# EAGLE design FuncGen_icl8038 (EAGLE 7.6.0)
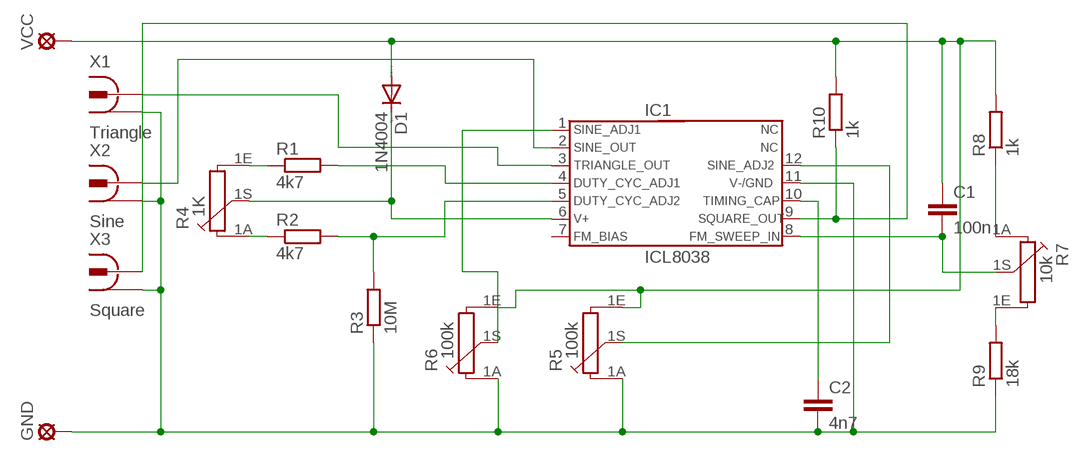
[diagram p0: schematic, sheet 1]

## Parts
C1  100n  C-EU025-025X050  [C025-025X050]
C2  4n7  C-EU025-025X050  [C025-025X050]
D1  1N4004  [DO41-10]
GND  LSP10  [LSP10]
IC1  ICL8038  [ICL8038]
R1  4k7  R-EU_0207/10  [0207/10]
R2  4k7  R-EU_0207/10  [0207/10]
R3  10M  R-EU_0207/10  [0207/10]
R4  1K  PC16S  [PC16S]
R5  100k  PC16S  [PC16S]
R6  100k  PC16S  [PC16S]
R7  10k  PC16S  [PC16S]
R8  1k  R-EU_0207/10  [0207/10]
R9  18k  R-EU_0207/10  [0207/10]
R10  1k  R-EU_0207/10  [0207/10]
VCC  LSP10  [LSP10]
X1  Triangle  736880-49  [736880-49]
X2  Sine  736880-49  [736880-49]
X3  Square  736880-49  [736880-49]

## Nets
N$2: C2.2 GND.MP IC1.11 R3.1 R5.1A R6.1A R9.1 X1.1 X1.1@1 X1.1@2 X2.1 X2.1@1 X2.1@2 X3.1 X3.1@1 X3.1@2
N$3: R1.1 R4.1E
N$4: R2.1 R4.1A
N$5: D1.C IC1.6 R4.1S
N$6: IC1.4 R1.2
N$7: IC1.5 R2.2 R3.2
N$8: IC1.9 R10.1 X3.2
N$9: C1.1 D1.A R5.1E R6.1E R8.2 R10.2 VCC.MP
N$10: IC1.1 R6.1S
N$11: IC1.12 R5.1S
N$12: C2.1 IC1.10
N$13: R7.1E R9.2
N$14: R7.1A R8.1
N$16: C1.2 IC1.8 R7.1S
N$18: IC1.3 X1.2
N$19: IC1.2 X2.2
Unconnected: IC1.7

## Library data of the parts
C1 C2 = rcl:C-EU: CAPACITOR, European symbol
D1 = diode:1N4004: DIODE general purpose rectifier, 1 A
GND VCC = solpad:LSP10: SOLDER PAD drill 1.0 mm, distributor Buerklin, 12H555
IC1 = ICL8038:ICL8038: ICL8038 Intersil ICL8038 Precision Waveform Generator/ Voltage Controlled Oscillator; AVAILABILITY: Unavailable; MF: Harris; MP: ICL8038; PACKAGE: None; PRICE: None
R1-R3 R8-R10 = resistor:R-EU_: RESISTOR, European symbol
R4-R7 = piher:PC16S: POTENTIOMETER single carbon potentiometer, 16 mm, S3ROH; OC_FARNELL: 4452940; OC_NEWARK: unknown
X1-X3 = con-conrad:736880-49: Cinch Connector ( RCA Jack ) Cinch-Einbaukupplung 90º 72345 Vernickelt BKL Electronic Source: Conrad <http://www.conrad.de/ce/de/product/736880>

## Board
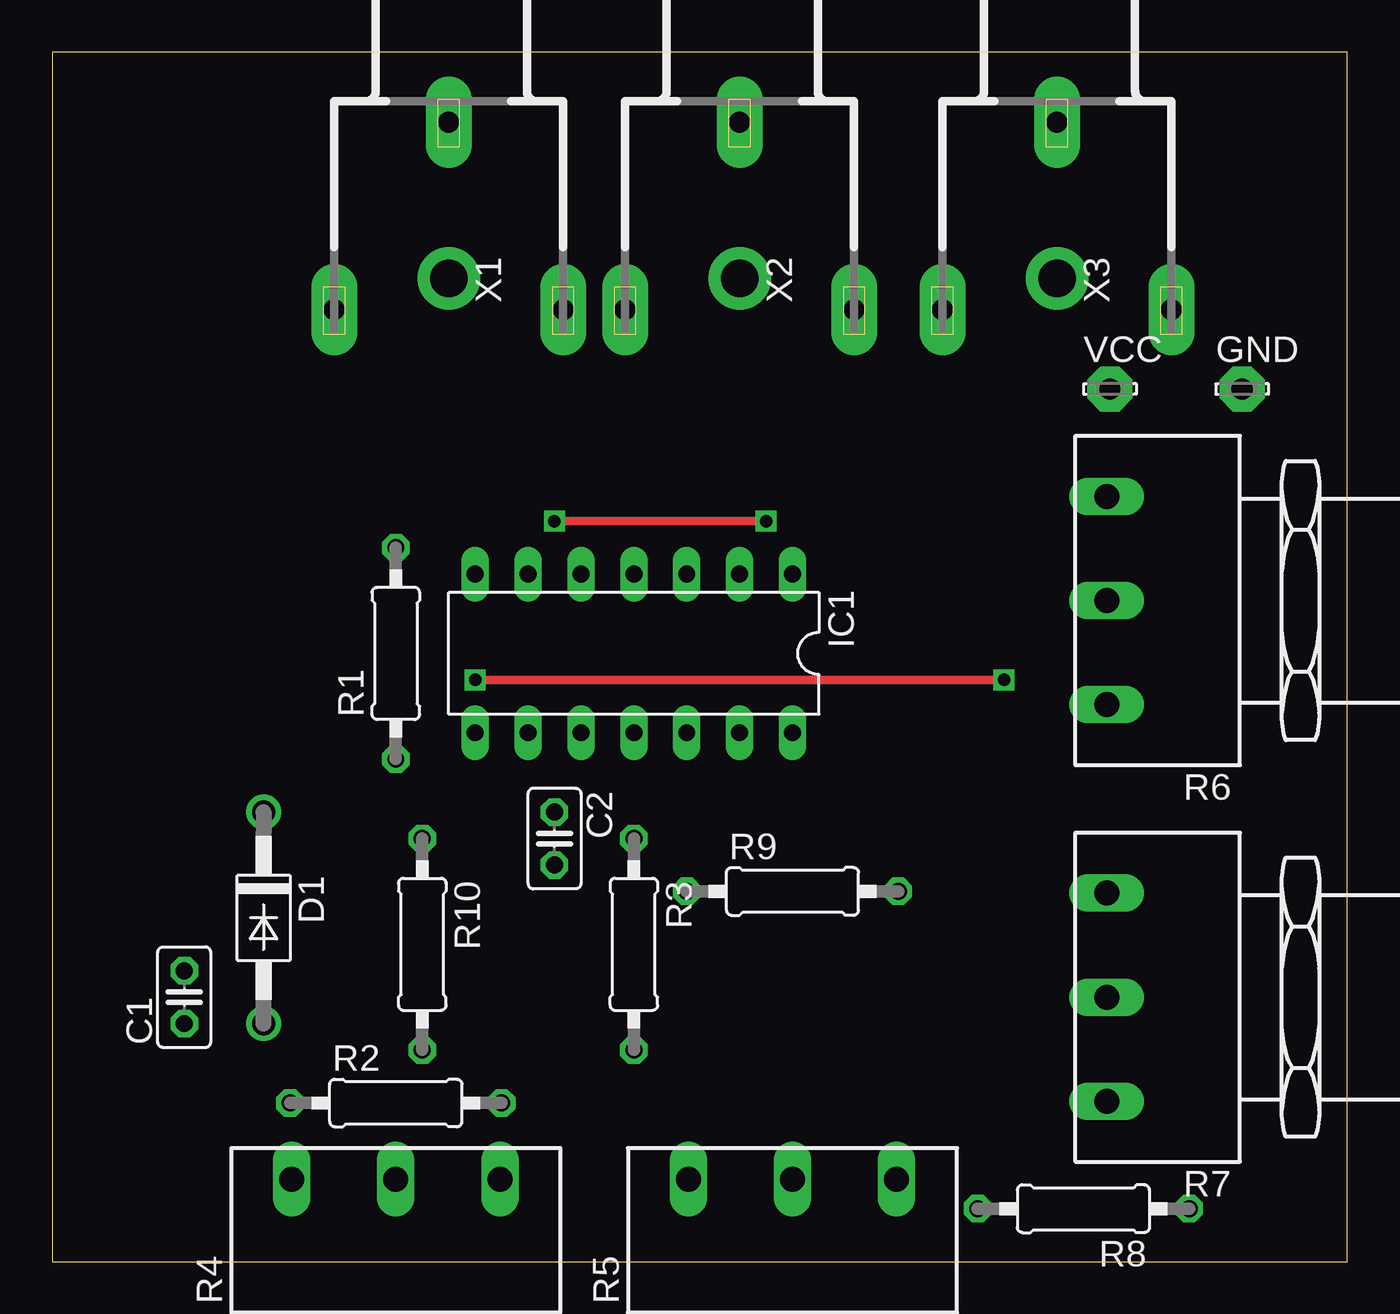
[diagram p1: board, top side]
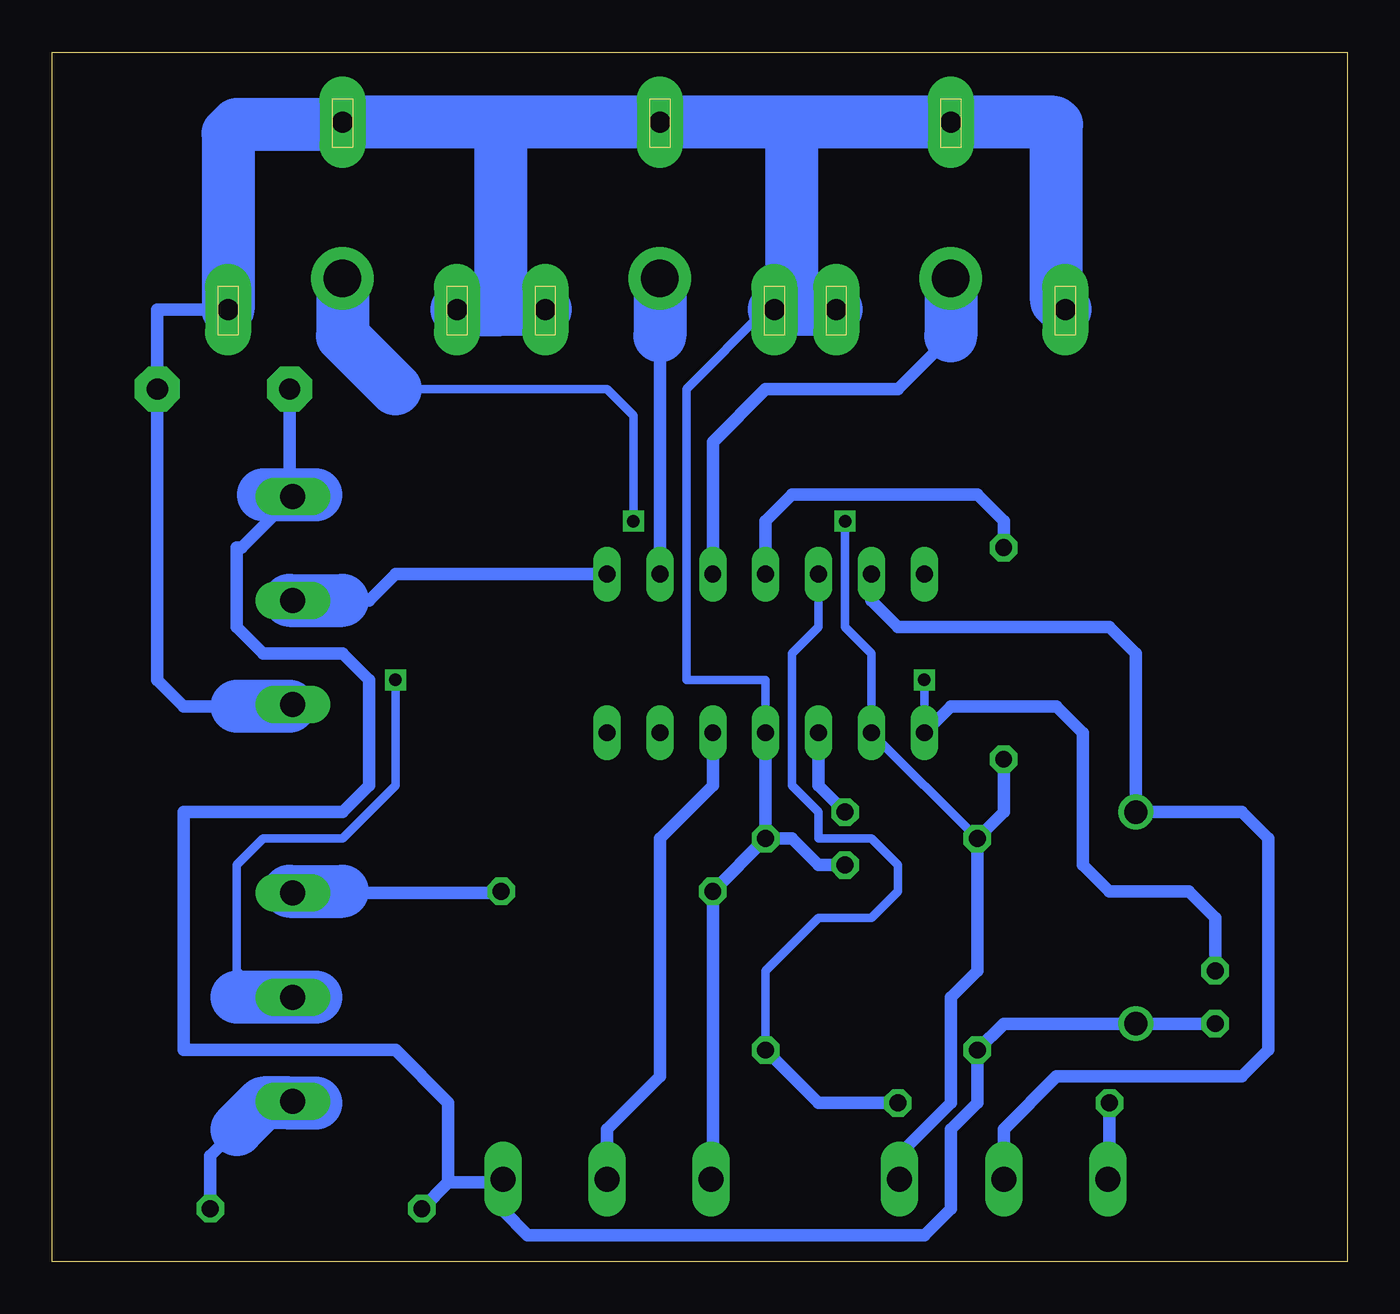
[diagram p2: board, bottom side, seen from below]

Size 62.21 x 58.09 mm. Coordinates in mm from the lower left corner, seen from the top.
Outline: 0,0 62.21,0 62.21,58.09 0,58.09 0,0
Copper layers (1*16): Top 0.035mm / dielectric 1.5mm / Bottom 0.035mm
Design rules "default": minimum track width 10mil, minimum drill 24mil, track to track 8mil, track to pad 8mil, pad to pad 8mil, via to via 8mil, smd to smd 8mil, copper to edge 40mil, drill to drill 8mil, minimum pad ring 10mil, minimum via ring 8mil, stop-mask expansion 4mil, vias tented up to drill 0mil, thermal gap 10mil

### Footprints (pad centres in the part's own frame; a part is rotated, then mirrored left to right if it is on the bottom)
C025-025X050 = drill 0.813 octagon: 1 -1.27,0; 2 1.27,0
DO41-10 = drill 1.118: A 5.08,0; C -5.08,0
LSP10 = drill 1.016 pad 2.159 octagon: MP 0,0
ICL8038 = drill 0.813 long: 1 -7.62,-3.81; 2 -5.08,-3.81; 3 -2.54,-3.81; 4 0,-3.81; 5 2.54,-3.81; 6 5.08,-3.81; 7 7.62,-3.81; 8 7.62,3.81; 9 5.08,3.81; 10 2.54,3.81; 11 0,3.81; 12 -2.54,3.81; 13 -5.08,3.81; 14 -7.62,3.81
0207/10 = drill 0.813 octagon: 1 -5.08,0; 2 5.08,0
PC16S = drill 1.2 long: 1A -5,6.5; 1E 5,6.5; 1S 0,6.5
736880-49 = drill 1 pad 2.2 long: 1 -3.92,0; 1@1 5.08,-5.5; 1@2 5.08,5.5 | drill 1.8 pad 3: 2 3.58,0

### Placement (x,y rotation side)
C1  6.35,12.7 90 top
C2  24.13,20.32 270 top
D1  10.16,16.51 270 top
GND  57.15,41.91 0 top
IC1  27.94,29.21 180 top
R1  16.51,29.21 90 top
R2  16.51,7.62 0 top
R3  27.94,15.24 270 top
R4  16.51,-2.54 0 top
R5  35.56,-2.54 0 top
R6  57.15,31.75 90 top
R7  57.15,12.7 90 top
R8  49.53,2.54 180 top
R9  35.56,17.78 0 top
R10  17.78,15.24 270 top
VCC  50.8,41.91 0 top
X1  19.05,50.8 270 top
X2  33.02,50.8 270 top
X3  48.26,50.8 270 top

### Tracks (layer width: path | path; a pad name or v marks a point on that pad's centre or on a via)
N$1
  Bottom 2.54: 52.07,36.83 49.53,36.83
N$2
  Bottom 0.406: IC1.11 27.94,27.94 31.75,27.94 31.75,41.91 27.94,45.72 X2.1@1
  Bottom 0.61: R3.1 R9.1 30.48,4.04 R5.1A | R3.1 IC1.11 | C2.2 25.4,19.05 26.67,20.32 R3.1 | X3.1@2 57.15,45.72 GND.MP 57.15,27.94 55.88,26.67 53.34,26.67 | R6.1A 50.73,26.67 50.8,26.67
  Bottom 2.54: X1.1@1 13.97,46.14 13.97,54.61 14.08,54.72 X1.1 26.67,54.72 | 26.67,54.72 X2.1 40.64,54.72 | 40.64,54.72 X3.1 48.37,54.61 53.34,54.61 53.76,54.19 X3.1@2 | X1.1@2 X2.1@1 26.67,46.57 26.67,54.72 | X2.1@2 40.64,45.72 | X3.1@1 40.64,45.72 | 40.64,45.72 40.64,54.72 | 50.8,26.67 53.34,26.67
N$3
  Bottom 0.61: R1.1 16.51,21.59 17.78,20.32 17.78,13.97 19.05,12.7 19.05,7.62 21.59,5.08 21.59,4.04 R4.1E
N$4
  Bottom 0.61: R4.1A 11.43,4.04 R2.1
N$5
  Bottom 0.61: IC1.6 22.86,31.75 21.59,30.48 11.43,30.48 10.16,29.21 D1.C 5.08,21.59 3.81,20.32 3.81,10.16 5.08,8.89 13.97,8.89 16.51,6.35 R4.1S
N$6
  Bottom 0.61: IC1.4 27.94,35.56 26.67,36.83 17.78,36.83 16.51,35.56 R1.2
N$7
  Bottom 0.406: IC1.5 25.4,30.48 26.67,29.21 26.67,22.86 25.4,21.59 25.4,20.32 22.86,20.32 21.59,19.05 21.59,17.78 22.86,16.51 25.4,16.51 27.94,13.97 R3.2
  Bottom 0.61: R2.2 25.4,7.62 R3.2
N$8  (via drill 0.6)
  Top 0.406: v24.13,35.56 v34.29,35.56
  Bottom 0.406: R10.1 IC1.9 22.86,29.21 24.13,30.48 v24.13,35.56 | X3.2 48.26,46.99 | 48.26,44.45 48.26,43.18 46.99,41.91 45.72,41.91 35.56,41.91 34.29,40.64 v34.29,35.56
  Bottom 2.54: 48.26,46.99 48.26,44.45 45.72,41.91
N$9
  Bottom 0.61: C1.1 D1.A 16.51,11.43 R10.2 17.78,7.62 19.05,6.35 19.05,2.54 20.32,1.27 39.37,1.27 40.56,2.46 R5.1E 40.71,3.81 43.18,3.81 | 43.18,3.81 R8.2 | VCC.MP 50.8,36.9 R6.1E 53.11,34.29 53.34,34.29 53.34,30.48 52.07,29.21 48.26,29.21 46.99,27.94 46.99,22.86 48.26,21.59 55.88,21.59 55.88,10.16 45.72,10.16 43.18,7.62 43.18,3.81
N$10
  Bottom 0.61: IC1.1 45.72,33.02 46.99,31.75 48.26,31.75 R6.1S
  Bottom 2.54: 50.8,31.75 48.26,31.75
N$11
  Bottom 0.61: IC1.12 30.48,22.86 33.02,20.32 33.02,8.89 35.56,6.35 R5.1S
N$12
  Bottom 0.61: C2.1 25.4,22.86 IC1.10
N$13
  Bottom 0.61: R9.2 40.72,17.7 R7.1E
N$14
  Bottom 0.61: R7.1A 50.73,7.62 50.8,7.62 | 53.34,6.35 54.61,5.08 R8.1
  Bottom 2.54: 53.34,6.35 52.07,7.62 50.8,7.62 49.53,7.62
N$15
  Bottom 2.54: 50.8,17.78 48.26,17.78
N$16  (via drill 0.6)
  Top 0.406: v20.32,27.94 v45.72,27.94
  Bottom 0.406: IC1.8 v20.32,27.94 | R7.1S 52.07,12.7 53.34,13.97 53.34,19.05 52.07,20.32 48.26,20.32 45.72,22.86 v45.72,27.94
  Bottom 0.61: C1.2 6.35,16.51 7.62,17.78 11.43,17.78 12.7,19.05 12.7,25.4 13.97,26.67 19.05,26.67 IC1.8
N$17
  Bottom 2.54: 49.53,12.7 53.34,12.7
N$18
  Bottom 0.61: X1.2 19.05,46.99 | 19.05,44.45 21.59,41.91 27.94,41.91 30.48,39.37 IC1.3
  Bottom 2.54: 19.05,46.99 19.05,44.45
N$19
  Bottom 0.61: X2.2 33.02,46.99 | 33.02,44.45 IC1.2
  Bottom 2.54: 33.02,46.99 33.02,44.45